# Altium schematic sheet ESP.SchDoc
size A4; SheetNumber: 1; SheetTotal: 2; SPICEModelCacheKNIWMKIR: <root> / <DocumentId>KNIWMKIR</DocumentId> / <CacheFrame Number="0"> / <Model Name="led1" Kind="MDL"> / <Text>*Typ RED GaAs LED: Vf=1.7V Vr=4V If=40mA trr=3uS / *LED Pinout: 1=A, 2=K / .MODEL LED1 D (IS=93.2P RS=42M N=3.73 BV=4 IBV=10U / + CJO=2.97P VJ=.75 M=.333 TT=4.32U)</Text> / </Model> / </CacheFrame> / </root>
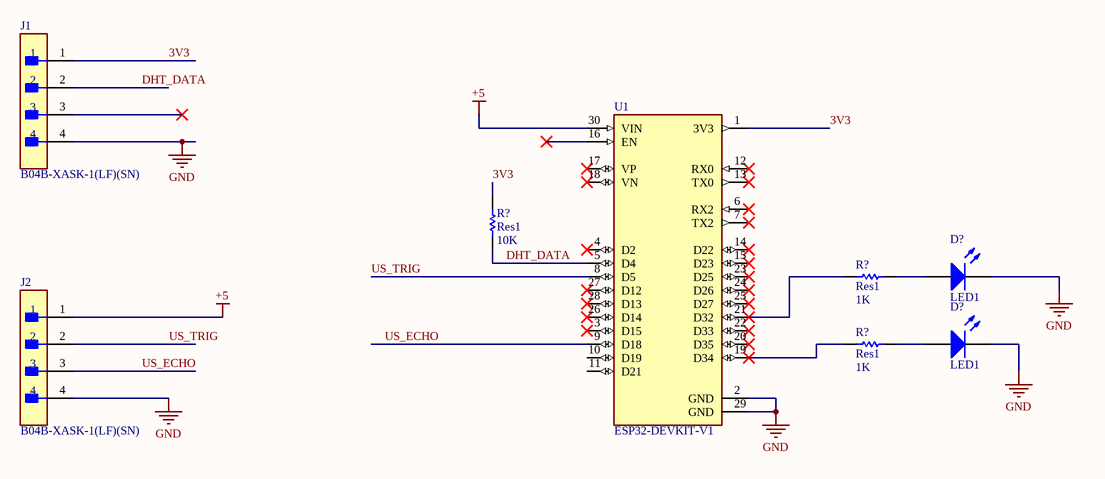
[diagram p0: ESP.SchDoc]

## Parts
(Parts that share a designator on the sheet are numbered #1, #2 ... from top to bottom, then left to right.)
D?#1  LED1  [LED-1]
D?#2  LED1  [LED-1]
J1  B04B-XASK-1(LF)(SN)  [FP-B04B-XASK-1_LF_SN-MFG]
J2  B04B-XASK-1(LF)(SN)  [FP-B04B-XASK-1_LF_SN-MFG]
R?#1  Res1  value 10K  [AXIAL-0.3]
R?#2  Res1  value 1K  [AXIAL-0.3]
R?#3  Res1  value 1K  [AXIAL-0.3]
U1  ESP32-DEVKIT-V1  [MODULE_ESP32_DEVKIT]

## Nets
+5: J2.1 U1.30(VIN)
GND: D?#1.2(K) D?#2.2(K) J1.4 J2.4 U1.2(GND) U1.29(GND)
3V3: J1.1 R?#1.2 U1.1(3V3)
DHT_DATA: J1.2 R?#1.1 U1.5(D4)
US_ECHO: J2.3 U1.9(D18)
US_TRIG: J2.2 U1.8(D5)
NetD?#1_1: D?#1.1(A) R?#2.2
NetD?#2_1: D?#2.1(A) R?#3.2
NetR?#2_1: R?#2.1 U1.21(D32)
NetR?#3_1: R?#3.1 U1.19(D34)

Not connected (* = marked no-connect by the designer): J1 3*; U1 3(D15)* 4(D2)* 6(RX2)* 7(TX2)* 10(D19) 11(D21) 12(RX0)* 13(TX0)* 14(D22)* 15(D23)* 16(EN)* 17(VP)* 18(VN)* 20(D35)* 22(D33)* 23(D25)* 24(D26)* 25(D27)* 26(D14)* 27(D12)* 28(D13)*

## Library data of the parts
D?#1 D?#2 = LED1: Typical RED GaAs LED; Published: 8-Jun-2000; LatestRevisionDate: 08-Jul-2005; LatestRevisionNote: Mech Layer 1 removed.; PackageReference: LED-1; Publisher: Altium Limited; PackageDescription: LED; 2 Leads
J1 J2 = CMP-17439-000018-1: CONN HEADER VERT 4POS 2.5MM; Manufacturer: JST; Current Rating: 3A; Voltage Rating: 250V; Conn Orientation: Straight; Conn Gender: Male; Number Of Contacts: 4; ComponentLink2Description: Datasheet; Package: B04B-XASK-1(LF)(SN); Octopart: https://octopart.com/b04b-xask-1%28lf%29%28sn%29-jst-3990149; Pitch: 2.5mm; Device Class L1: Connectors; RoHS: TRUE; Device Class L3: unset; Manufacturer Part Number: B04B-XASK-1(LF)(SN); Temperature Range High: +85°C; Height: 8.8mm; Lead Free: Yes; Category: Conn; Temperature: -25°C to +85°C; Digikey Description: CONN HEADER VERT 4POS 2.5MM; Temperature Range Low: -25°C; ComponentLink2URL: http://www.jst-mfg.com/product/pdf/eng/eXA1.pdf; Contact Material: Tin,Copper; Device Class L2: Headers and Wire Housings; Automotive: No; Number Of Rows: 1
R?#1-R?#3 = Res1: Resistor; Published: 8-Jun-2000; LatestRevisionDate: 17-Jul-2002; LatestRevisionNote: Re-released for DXP Platform.; PackageReference: AXIAL-0.3; Publisher: Altium Limited; PackageDescription: Axial Device, Thru-Hole; 2 Leads; 0.3 in Pin Spacing
U1 = ESP32-DEVKIT-V1: Dual core, Wi-Fi: 2.4 GHz up to 150 Mbits/s,BLE (Bluetooth Low Energy) and legacy Bluetooth, 32 bits, Up to 240 MHz; MF: Do it; Price: None; Availability: Not in stock; Package: None; MP: ESP32-DEVKIT-V1; Value: *; SnapEDA_Link: https://www.snapeda.com/parts/ESP32-DEVKIT-V1/Do+it/view-part/?ref=snap; Check_prices: https://www.snapeda.com/parts/ESP32-DEVKIT-V1/Do+it/view-part/?ref=eda